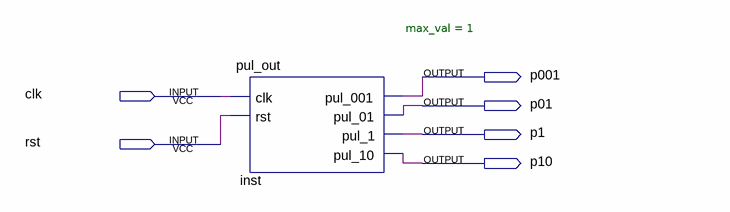
[diagram p0: schematic sheet]
// Quartus schematic pul.bdf as structural Verilog: 1 symbols, 6 pins
module pul (
  input  clk,
  input  rst,
  output p001,
  output p01,
  output p1,
  output p10
);

  pul_out #(.max_val(1)) inst (.clk(clk), .rst(rst), .pul_001(p001), .pul_01(p01), .pul_1(p1), .pul_10(p10));
endmodule
